# EasyEDA schematic 1-Schematic_Arduino_Based_Weather_Station.json
TITLE: Sheet_1; REV: 1.0; Date: 2021-01-07; Sheet: 1/1; Drawn By: kon_paras; Company: Your Company
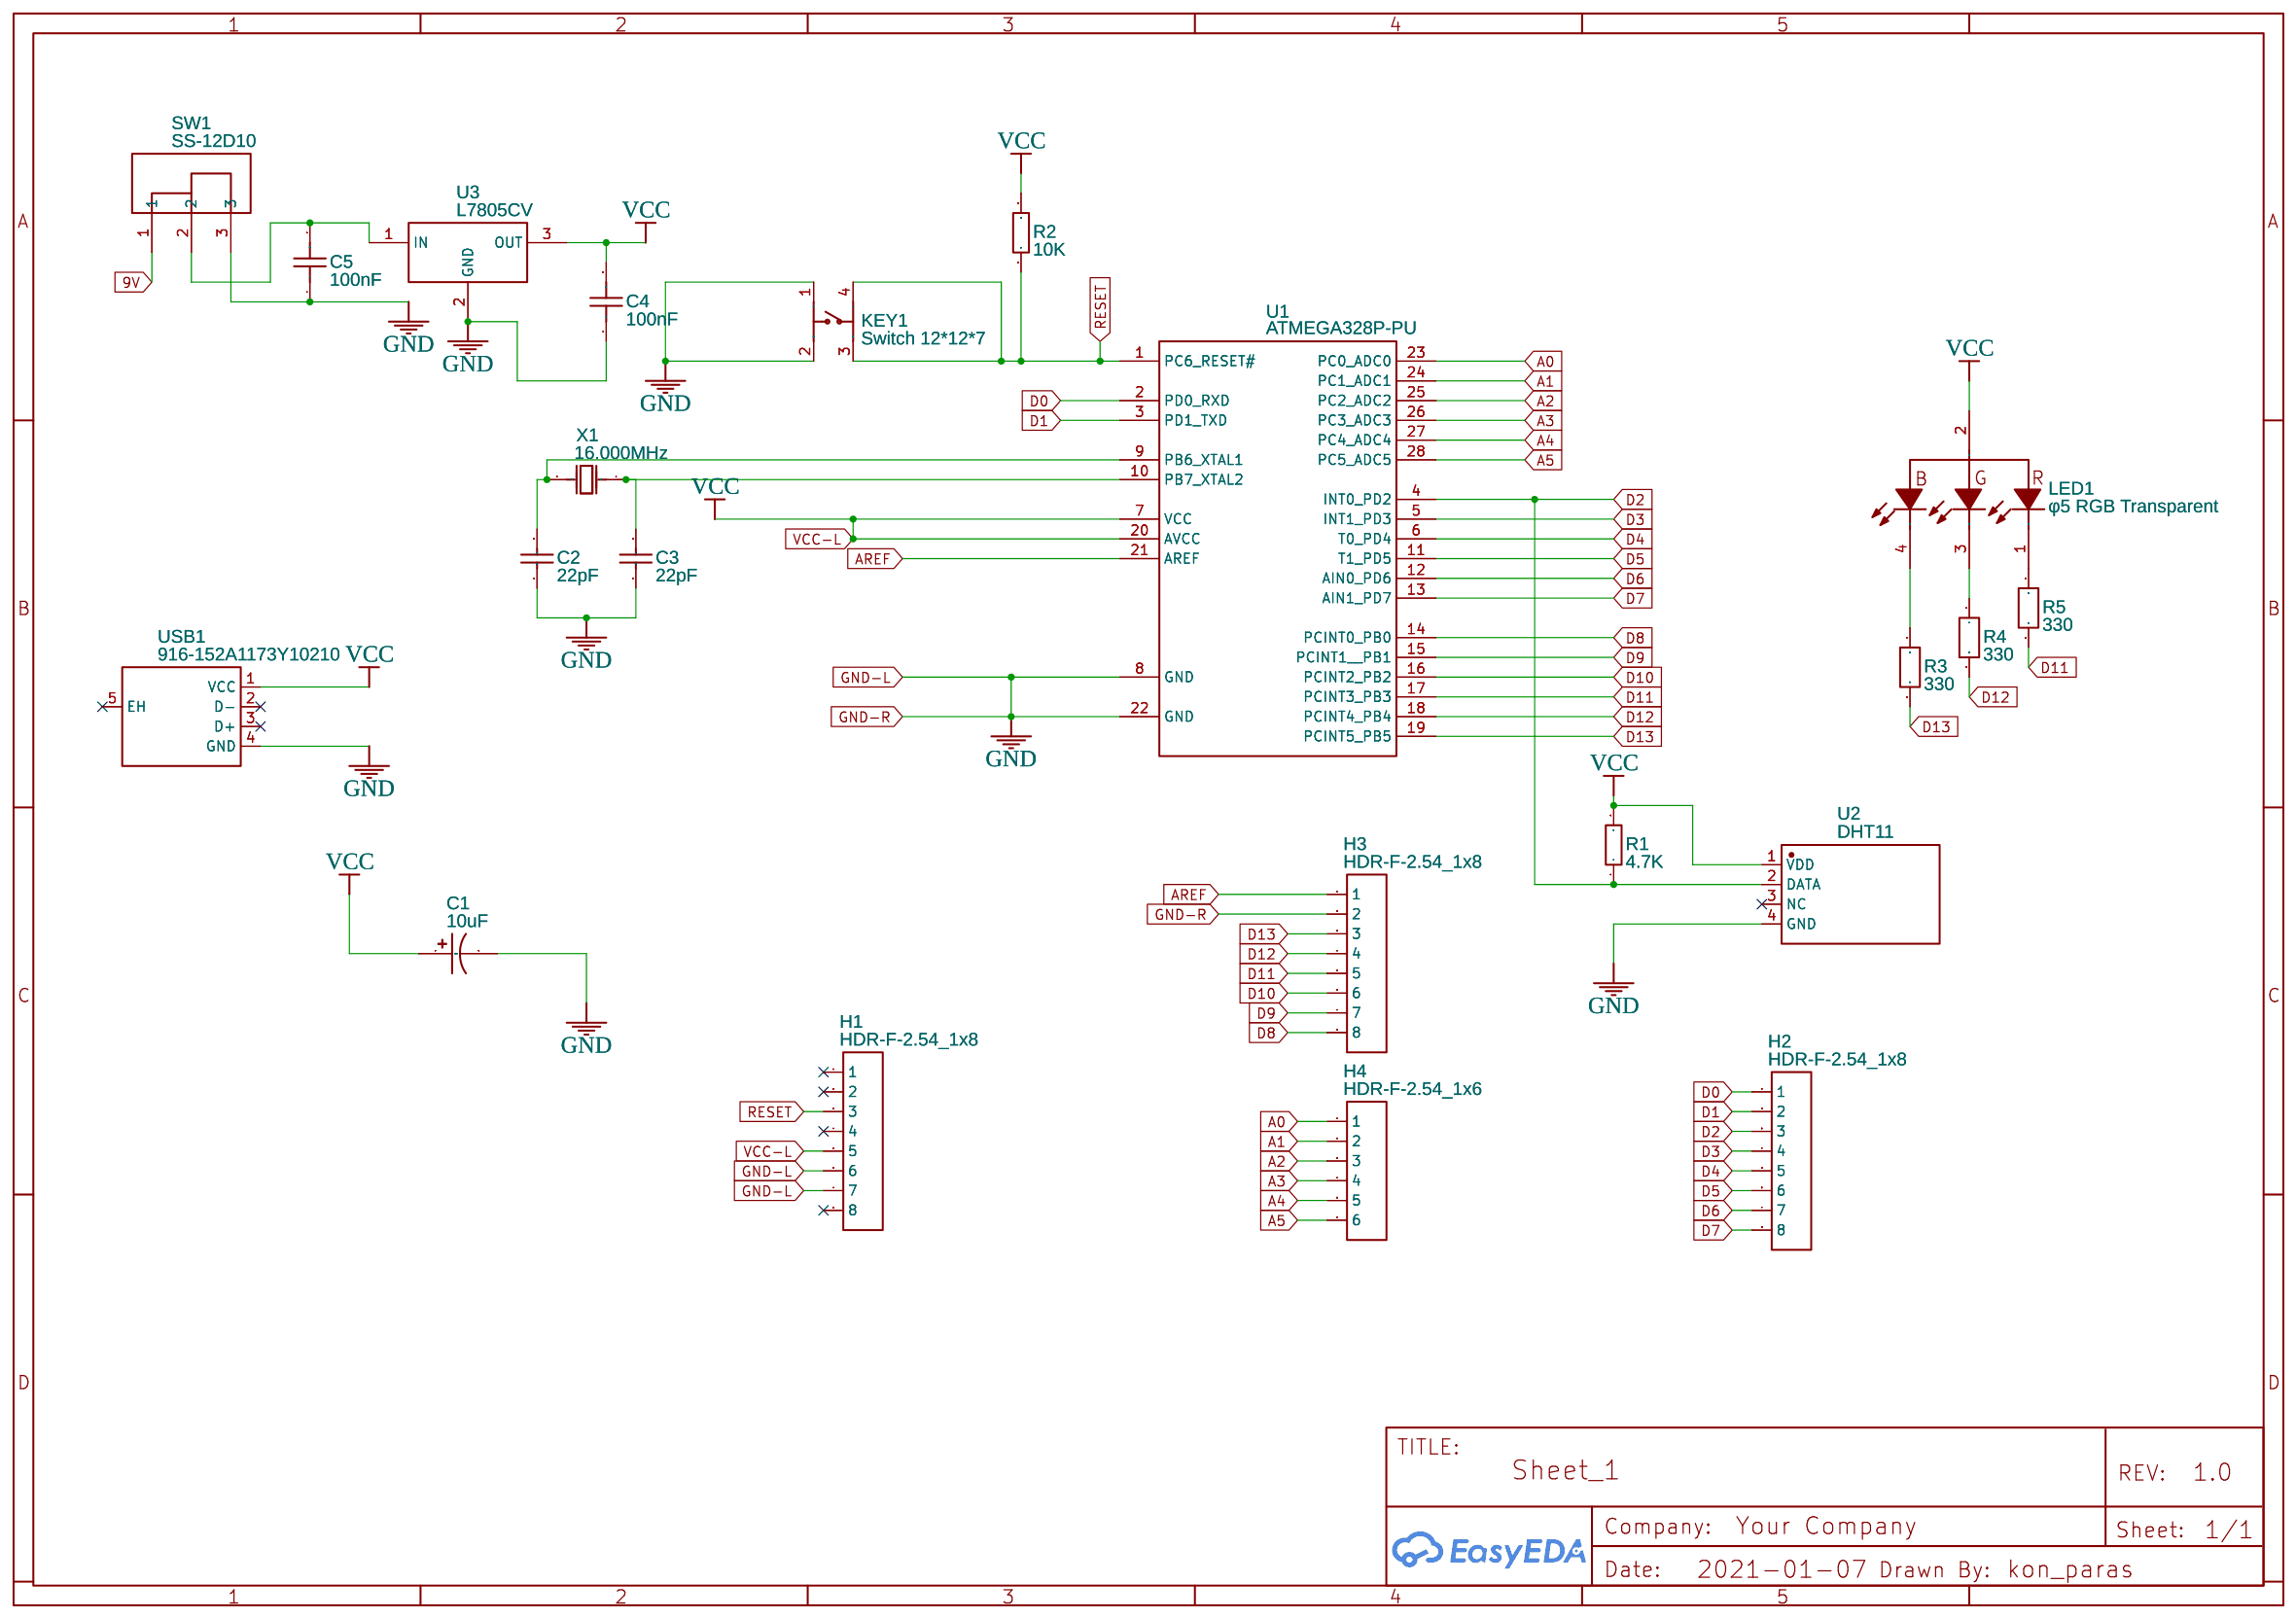
[diagram p0: schematic sheet]

## Parts
C1  10uF  [CAP-TH_BD5.0-P2.00-D0.8-FD]
C2  22pF  [CAP-TH_L5.0-W2.5-P5.08-D0.7]
C3  22pF  [CAP-TH_L5.0-W2.5-P5.08-D0.7]
C4  100nF  [CAP-TH_L5.0-W2.5-P5.08-D0.7]
C5  100nF  [CAP-TH_L5.0-W2.5-P5.08-D0.7]
H1  HDR-F-2.54_1x8  [HDR-F-2.54_1X8]
H2  HDR-F-2.54_1x8  [HDR-F-2.54_1X8]
H3  HDR-F-2.54_1x8  [HDR-F-2.54_1X8]
H4  HDR-F-2.54_1x6  [HDR-F-2.54_1X6]
KEY1  Switch 12*12*7  [KEY-TH_4P-L11.7-W11.5-P5.00-LS12.5]
LED1  φ5 RGB Transparent  [LED-TH_4P-BD5.8-P1.30]
R1  4.7K  [RES-TH_BD4.0-L10.5-P14.50-D0.6]
R2  10K  [RES-TH_BD3.0-L9.5-P13.50-D0.6]
R3  330  [RES-TH_BD2.4-L6.3-P10.30-D0.6]
R4  330  [RES-TH_BD2.4-L6.3-P10.30-D0.6]
R5  330  [RES-TH_BD2.4-L6.3-P10.30-D0.6]
SW1  SS-12D10  [SS-12D10]
U1  ATMEGA328P-PU  [DIP-28_L34.6-W7.3-P2.54-LS10.2-BL]
U2  DHT11  [SENSOR-TH_DHT11]
U3  L7805CV  [TO-220-3_L10.0-W4.5-P2.54-L]
USB1  916-152A1173Y10210  [USB-A-TH_916-152A1173Y10210]
X1  16.000MHz  [HC-49US_L11.5-W4.5-P4.88]

## Library data of the parts
C1 = 25MH710MEFCT55X7: Supplier: LCSC; Supplier Part: C473156; Manufacturer: Rubycon; Contributor: LCSC
C2 C3 = L06S1B220KN0B0S0N0: Supplier: LCSC; Supplier Part: C260720; Manufacturer: Songtian Elec; Contributor: LCSC
C4 C5 = CC1H104ZC1PD3F5P30MF: Supplier: LCSC; Supplier Part: C254069; Manufacturer: Dersonic; Contributor: LCSC
H1-H3 = HDR-F-2.54_1x8: Supplier Part: C225505; Supplier: LCSC; Contributor: LCEDA_Lib
H4 = HDR-F-2.54_1x6: Supplier Part: C40877; Supplier: LCSC; Contributor: LCEDA_Lib
KEY1 = Switch 12*12*7: Supplier Part: C14248; Supplier: LCSC; Manufacturer: ReliaPro
LED1 = φ5 RGB Transparent: Supplier: LCSC; Manufacturer: KENTO; Manufacturer Part: φ5 RGB Transparent LED; Contributor: LCSC; Supplier Part: C32985
R1 = RD50T5472J: Supplier: LCSC; Supplier Part: C167584; Manufacturer: TA-I Tech; Contributor: LCSC
R2 = CFR0S2J0103A10: Supplier: LCSC; Manufacturer: UniOhm; Supplier Part: C61283
R3-R5 = RN 1/2WS 330R F T/B A1: Supplier: LCSC; Supplier Part: C433516; Manufacturer: TyoHM; Contributor: LCSC
SW1 = SS-12D10: Supplier Part: undefined; Supplier: LCSC; Manufacturer: ReliaPro
U1 = ATMEGA328P-PU: sourceId: Oic6oiASL; Supplier: LCSC; Manufacturer: MICROCHIP; image: //image.lceda.cn/szlcsc/C33901.jpg; Contributor: LCSC; Supplier Part: C33901
U2 = DHT11: Supplier: LCSC; Supplier Part: C117051; Manufacturer: Aosong (Guangzhou) Elec; Contributor: LCSC
U3 = L7805CV: Supplier: LCSC; Manufacturer: STMicroelectronics; Supplier Part: C111887; LCSC Assembly: Yes; SMT Type: Extend
USB1 = 916-152A1173Y10210: Supplier: LCSC; Supplier Part: C708918; Manufacturer: Jing Extension of the Electronic Co.; Contributor: LCSC
X1 = X49SD110592MSD2SC: Supplier: LCSC; Manufacturer: YXC; Supplier Part: C2203

## Nets
9V: SW1.1
GND: C1.2 C2.1 C3.1 C4.1 C5.1 H1.6 H1.7 H3.2 KEY1.1 KEY1.2 SW1.3 U1.8(GND) U1.22(GND) U2.4(GND) U3.2(GND) USB1.4(GND)
VCC: C1.1 C4.2 H1.5 LED1.2(CA) R1.2 R2.2 U1.7(VCC) U1.20(AVCC) U2.1(VDD) U3.3(OUT) USB1.1(VCC)
A0: H4.1 U1.23(PC0 ADC0)
A1: H4.2 U1.24(PC1 ADC1)
A2: H4.3 U1.25(PC2 ADC2)
A3: H4.4 U1.26(PC3 ADC3)
A4: H4.5 U1.27(PC4 ADC4)
A5: H4.6 U1.28(PC5 ADC5)
AREF: H3.1 U1.21(AREF)
D0: H2.1 U1.2(PD0 RXD)
D1: H2.2 U1.3(PD1 TXD)
D2: H2.3 R1.1 U1.4(INT0 PD2) U2.2(DATA)
D3: H2.4 U1.5(INT1 PD3)
D4: H2.5 U1.6(T0 PD4)
D5: H2.6 U1.11(T1 PD5)
D6: H2.7 U1.12(AIN0 PD6)
D7: H2.8 U1.13(AIN1 PD7)
D8: H3.8 U1.14(PCINT0 PB0)
D9: H3.7 U1.15(PCINT1  PB1)
D10: H3.6 U1.16(PCINT2 PB2)
D11: H3.5 R5.2 U1.17(PCINT3 PB3)
D12: H3.4 R4.2 U1.18(PCINT4 PB4)
D13: H3.3 R3.2 U1.19(PCINT5 PB5)
RESET: H1.3 KEY1.3 KEY1.4 R2.1 U1.1(PC6 RESET#)
Net-(C2-2): C2.2 U1.9(PB6 XTAL1) X1.2(OSC2)
Net-(C3-2): C3.2 U1.10(PB7 XTAL2) X1.1(OSC1)
Net-(C5-2): C5.2 SW1.2 U3.1(IN)
Net-(LED1-1): LED1.1(KR) R5.1
Net-(LED1-3): LED1.3(KG) R4.1
Net-(LED1-4): LED1.4(KB) R3.1

Not connected (* = marked no-connect by the designer): H1 1* 2* 4* 8*; U2 3(NC)*; USB1 2(D-)* 3(D+)* 5(EH)*
